# EAGLE schematic goodfet30 (EAGLE 5.06)
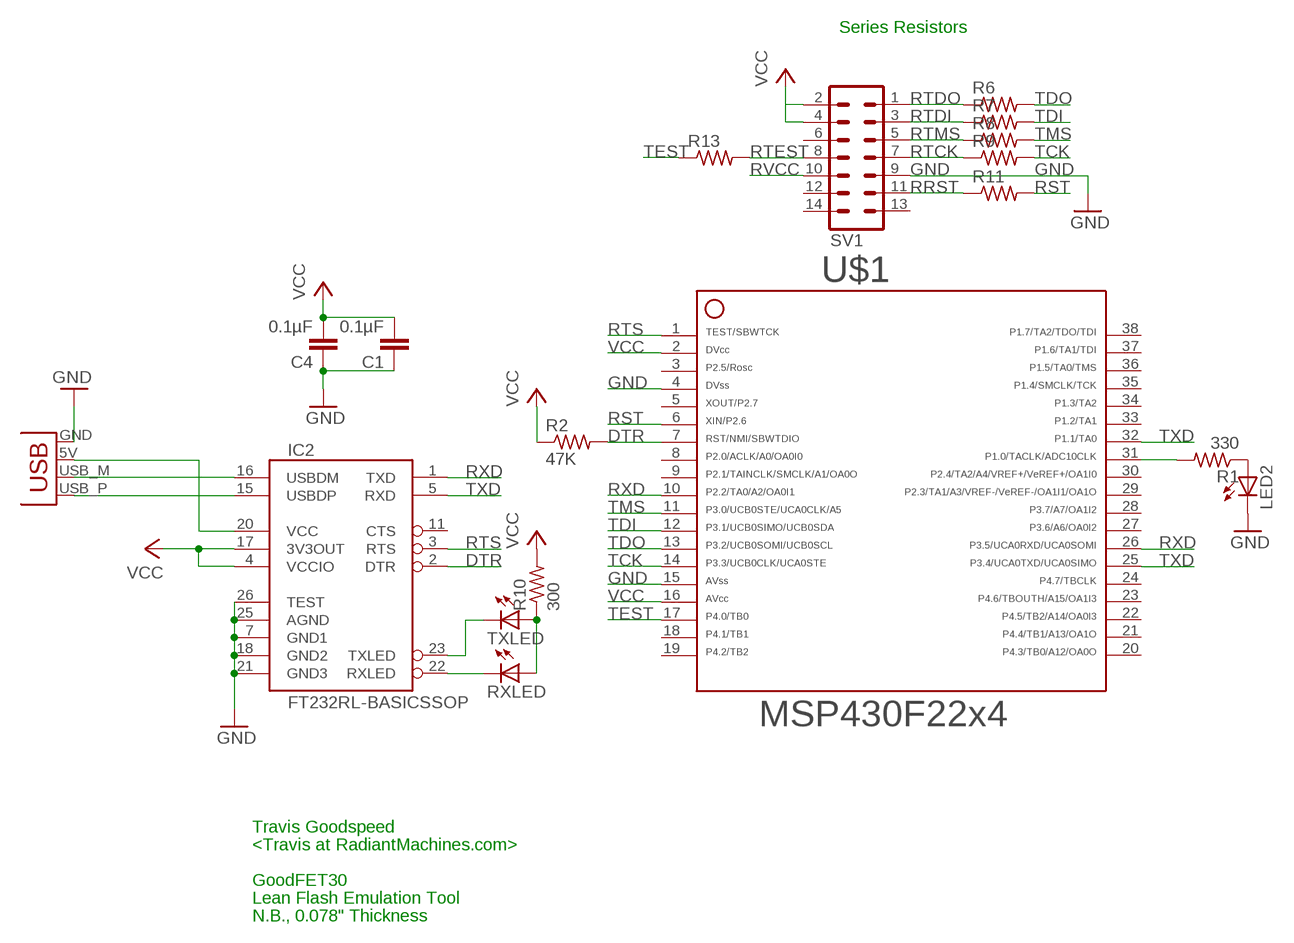
[diagram p0: schematic, sheet 1]

## Parts
C1  0.1µF  C-EUC0603  [C0603]
C4  0.1µF  C-EUC0603  [C0603]
IC2  FT232RL-BASICSSOP  [SSOP28DB]
LED2  LEDCHIP-LED0603  [CHIP-LED0603]
R1  330  R-US_R0603  [R0603]
R2  47K  R-US_R0603  [R0603]
R6  R-US_R0603  [R0603]
R7  R-US_R0603  [R0603]
R8  R-US_R0603  [R0603]
R9  R-US_R0603  [R0603]
R10  300  R-US_R0603  [R0603]
R11  R-US_R0603  [R0603]
R13  R-US_R0603  [R0603]
RXLED  LEDCHIP-LED0603  [CHIP-LED0603]
SV1  MA07-2  [MA07-2]
TXLED  LEDCHIP-LED0603  [CHIP-LED0603]
U$1  F22X4---DA38  [DA38]
X1  USBPCB  [USB-A-PCB]

## Nets
DTR: IC2.2(DTR) R2.2 U$1.7
GND: C1.1 C4.1 IC2.7(GND1) IC2.18(GND2) IC2.21(GND3) IC2.25(AGND) IC2.26(TEST) LED2.C SV1.9 U$1.4 U$1.15 X1.GND
N$3: IC2.15(USBDP) X1.USB_P(D+)
N$4: IC2.16(USBDM) X1.USB_M(D-)
N$5: IC2.20(VCC) X1.5V(VBUS)
N$6: IC2.22(RXLED) RXLED.C
N$7: IC2.23(TXLED) TXLED.C
N$8: R10.1 RXLED.A TXLED.A
N$9: R1.2 U$1.31
N$10: LED2.A R1.1
RRST: R11.1 SV1.11
RST: R11.2 U$1.6
RTCK: R9.1 SV1.7
RTDI: R7.1 SV1.3
RTDO: R6.1 SV1.1
RTEST: R13.2 SV1.8
RTMS: R8.1 SV1.5
RTS: IC2.3(RTS) U$1.1
RVCC: SV1.10
RXD: IC2.1(TXD) U$1.10 U$1.26
TCK: R9.2 U$1.14
TDI: R7.2 U$1.12
TDO: R6.2 U$1.13
TEST: R13.1 U$1.17
TMS: R8.2 U$1.11
TXD: IC2.5(RXD) U$1.25 U$1.32
VCC: C1.2 C4.2 IC2.4(VCCIO) IC2.17(3V3OUT) R2.1 R10.2 SV1.2 SV1.4 U$1.2 U$1.16
Unconnected: IC2.11(CTS) SV1.6 SV1.12 SV1.13 SV1.14 U$1.3 U$1.5 U$1.8 U$1.9 U$1.18 U$1.19 U$1.20 U$1.21 U$1.22 U$1.23 U$1.24 U$1.27 U$1.28 U$1.29 U$1.30 U$1.33 U$1.34 U$1.35 U$1.36 U$1.37 U$1.38

## Notes on the sheet
- Series Resistors
- Travis Goodspeed
- <Travis at RadiantMachines.com>
- GoodFET30
- Lean Flash Emulation Tool
- N.B., 0.078" Thickness

## Library data of the parts
C1 C4 = rcl:C-EU: CAPACITOR, European symbol
IC2 = SparkFun:FT232RL-BASIC: USB UART This is the simplified version of the FT232RL unit. Only what you need, nothing you don't. Spark Fun Electronics SKU : COM-00650
LED2 RXLED TXLED = led:LED: LED OSRAM: - CHIPLED LG R971, LG N971, LY N971, LG Q971, LY Q971, LO R971, LY R971 LH N974, LH R974 LS Q976, LO Q976, LY Q976 LO Q996 - Hyper CHIPLED LW Q18S LB Q993, LB Q99A, LB R99A - SideLED LS A670, LO A670, LY A670, LG A670, LP A670 LB A673, LV A673, LT A673, LW A673 LH A674 LY A675 LS A676, LA A676, LO A676, LY A676, LW A676 LS A679, LY A679, LG A679 - Hyper Micro SIDELED® LS Y876, LA Y876, LO Y876, LY Y876 LT Y87S - SmartLED LW L88C, LW L88S LB L89C, LB L89S, LG L890 LS L89K, LO L89K, LY L89K LS L896, LA L896, LO L896, LY L896 - TOPLED LS T670, LO T670, LY T670, LG T670, LP T670 LSG T670, LSP T670, LSY T670, LOP T670, LYG T670 LG T671, LOG T671, LSG T671 LB T673, LV T673, LT T673, LW T673 LH T674 LS T676, LA T676, LO T676, LY T676, LB T676, LH T676, LSB T676, LW T676 LB T67C, LV T67C, LT T67C, LS T67K, LO T67K, LY T67K, LW E67C LS E67B, LA E67B, LO E67B, LY E67B, LB E67C, LV E67C, LT E67C LW T67C LS T679, LY T679, LG T679 LS T770, LO T770, LY T770, LG T770, LP T770 LB T773, LV T773, LT T773, LW T773 LH T774 LS E675, LA E675, LY E675, LS T675 LS T776, LA T776, LO T776, LY T776, LB T776 LHGB T686 LT T68C, LB T68C - Hyper Mini TOPLED® LB M676 - Mini TOPLED Santana® LG M470 LS M47K, LO M47K, LY M47K Source: http://www.osram.convergy.de LUXEON: - LUMILED® LXK2-PW12-R00, LXK2-PW12-S00, LXK2-PW14-U00, LXK2-PW14-V00 LXK2-PM12-R00, LXK2-PM12-S00, LXK2-PM14-U00 LXK2-PE12-Q00, LXK2-PE12-R00, LXK2-PE12-S00, LXK2-PE14-T00, LXK2-PE14-U00 LXK2-PB12-K00, LXK2-PB12-L00, LXK2-PB12-M00, LXK2-PB14-N00, LXK2-PB14-P00, LXK2-PB14-Q00 LXK2-PR12-L00, LXK2-PR12-M00, LXK2-PR14-Q00, LXK2-PR14-R00 LXK2-PD12-Q00, LXK2-PD12-R00, LXK2-PD12-S00 LXK2-PH12-R00, LXK2-PH12-S00 LXK2-PL12-P00, LXK2-PL12-Q00, LXK2-PL12-R00 Source: www.luxeon.com KINGBRIGHT: KA-3528ASYC Source: www.kingbright.com
R1 R2 R10 = rcl:R-US_: RESISTOR, American symbol
R6-R9 R11 R13 = resistor:R-US_: RESISTOR, American symbol
SV1 = con-lstb:MA07-2: PIN HEADER
U$1 = TI_MSP430_v13:F22X4---DA38: ***MSP430F22x4***DA38
X1 = SparkFun:USB: USB Connectors USB-B-PTH is fully proven SKU : PRT-00139 USB-miniB is fully proven SKU : PRT-00587 USB-A-PCB is untested. USB-A-H is throughly reviewed, but untested. Spark Fun Electronics SKU : PRT-00437 USB-B-SMT is throughly reviewed, but untested. Needs silkscreen touching up. USB-A-S has not been used/tested USB-MB-H has not been used/tested